# Altium schematic sheet ESS-BoB - CSDJ Interface.SchDoc: ESS-BoB - CSDJ Interface
size A4; DrawnBy: Guy Ovadia; Engineer: Guy Ovadia; Organization: TAMI Hackerspace; DocumentNumber: xxx; Revision: REV_NOT_USED
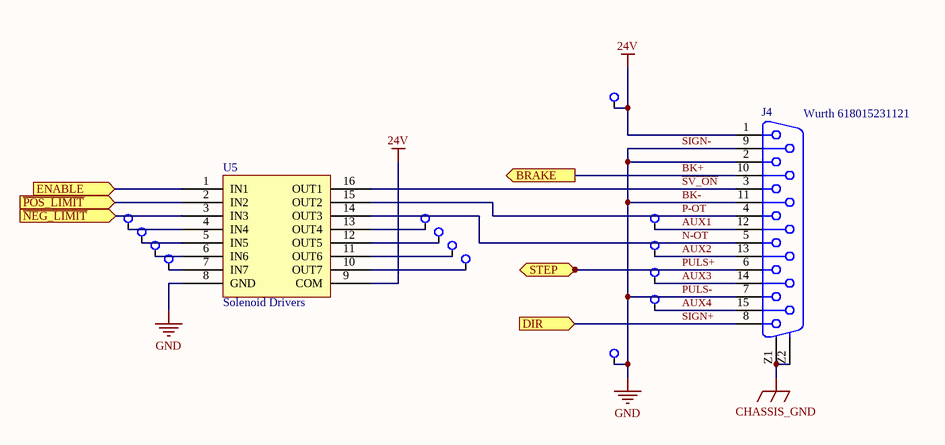
[diagram p0: ESS-BoB - CSDJ Interface.SchDoc]

## Parts
(Parts that share a designator on the sheet are numbered #1, #2 ... from top to bottom, then left to right.)
J4  Wurth 618015231121  [D-SUB15 TH RA]
TP?#1  24V  [TP_LOOP_1MM - WHITE]  (value not drawn)
TP?#2  (no value)  [TP_LOOP_1MM - WHITE]
TP?#3  (no value)  [TP_LOOP_1MM - WHITE]
TP?#4  AUX1  [TP_LOOP_1MM - WHITE]  (value not drawn)
TP?#5  (no value)  [TP_LOOP_1MM - WHITE]
TP?#6  (no value)  [TP_LOOP_1MM - WHITE]
TP?#7  (no value)  [TP_LOOP_1MM - WHITE]
TP?#8  (no value)  [TP_LOOP_1MM - WHITE]
TP?#9  AUX2  [TP_LOOP_1MM - WHITE]  (value not drawn)
TP?#10  (no value)  [TP_LOOP_1MM - WHITE]
TP?#11  (no value)  [TP_LOOP_1MM - WHITE]
TP?#12  AUX3  [TP_LOOP_1MM - WHITE]  (value not drawn)
TP?#13  AUX4  [TP_LOOP_1MM - WHITE]  (value not drawn)
TP?#14  GND  [TP_LOOP_1MM - BLACK]  (value not drawn)
U5  Solenoid Drivers  [TI D016_M (SOIC16)]

## Ports
BRAKE (out), DIR (in), ENABLE (in), STEP (in), ~{NEG_LIMIT} (in), ~{POS_LIMIT} (in)

## Nets
24V: J4.1 TP?#1.1(TP) U5.9(COM)
BK-: J4.2 J4.7 J4.9 J4.11 TP?#14.1(TP) U5.8(GND)  [also labelled GND, PULS-, SIGN-]
CHASSIS_GND: J4.Z1(GND) J4.Z2(GND)
~{NEG_LIMIT}: U5.3(IN3) ; port ~{NEG_LIMIT}
~{POS_LIMIT}: U5.2(IN2) ; port ~{POS_LIMIT}
~{SV_ON}: J4.3 U5.16(OUT1)
AUX1: J4.12 TP?#4.1(TP)
AUX2: J4.13 TP?#9.1(TP)
AUX3: J4.14 TP?#12.1(TP)
AUX4: J4.15 TP?#13.1(TP)
BK+: J4.10 ; port BRAKE
ENABLE: U5.1(IN1) ; port ENABLE
N-OT: J4.5 U5.14(OUT3)
P-OT: J4.4 U5.15(OUT2)
PULS+: J4.6 ; port STEP
SIGN+: J4.8 ; port DIR
NetTP?#2_1: TP?#2.1(TP) U5.4(IN4)
NetTP?#3_1: TP?#3.1(TP) U5.13(OUT4)
NetTP?#5_1: TP?#5.1(TP) U5.5(IN5)
NetTP?#6_1: TP?#6.1(TP) U5.12(OUT5)
NetTP?#7_1: TP?#7.1(TP) U5.6(IN6)
NetTP?#8_1: TP?#8.1(TP) U5.11(OUT6)
NetTP?#10_1: TP?#10.1(TP) U5.7(IN7)
NetTP?#11_1: TP?#11.1(TP) U5.10(OUT7)

## Notes on the sheet
- Date:
- Revision:
- Sheet
- P/N:
- of
- File:
- Size:
- A4

## Library data of the parts
J4 = D-Sub-15 Wurth 618015231121: WR-DSUB Female Angled PCB Connector
TP?#1-TP?#14 = TEST_POINT
U5 = TPL7407L: Solenoid Driver